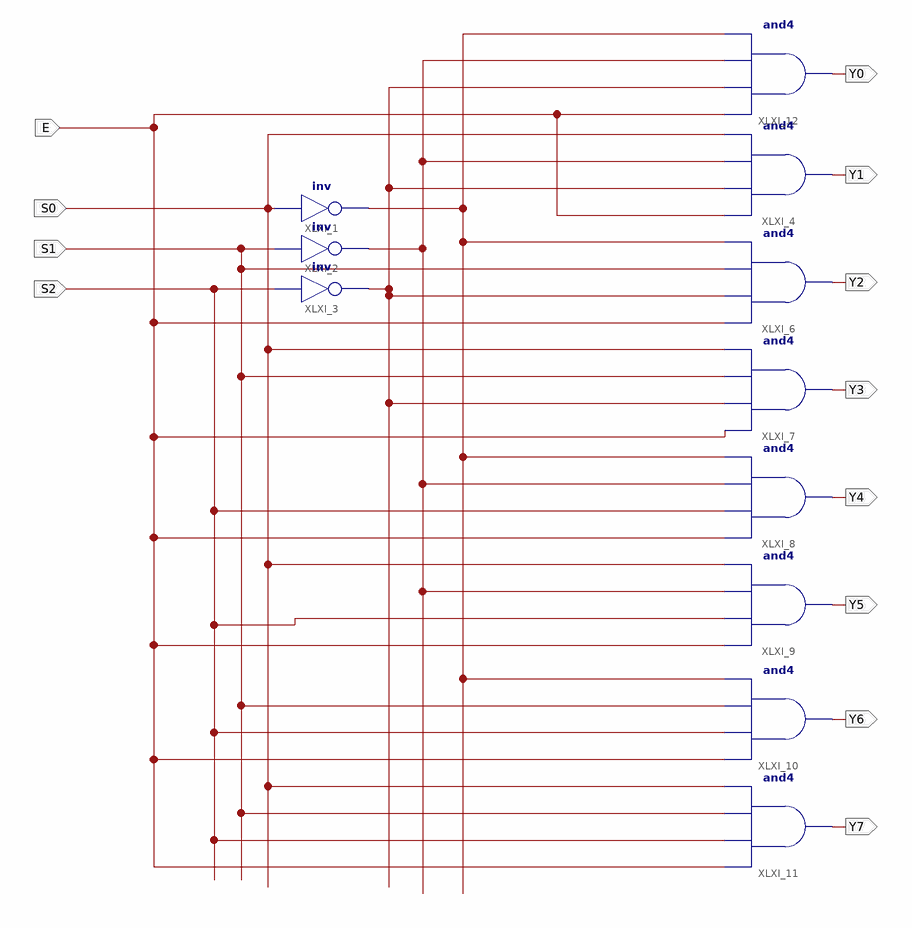
[diagram p0: schematic sheet 1]
// Xilinx ISE schematic decoder_3_8.sch (artix7) as structural Verilog: 11 symbols, 12 ports
module decoder_3_8 (
  input  S1,
  input  S2,
  input  S0,
  input  E,
  output Y0,
  output Y1,
  output Y2,
  output Y3,
  output Y4,
  output Y5,
  output Y6,
  output Y7
);

  wire XLXN_1, XLXN_2, XLXN_7;

  not XLXI_1 (XLXN_1, S0);
  not XLXI_2 (XLXN_2, S1);
  not XLXI_3 (XLXN_7, S2);
  and XLXI_4 (Y1, E, XLXN_7, XLXN_2, S0);
  and XLXI_6 (Y2, E, XLXN_7, S1, XLXN_1);
  and XLXI_7 (Y3, E, XLXN_7, S1, S0);
  and XLXI_8 (Y4, E, S2, XLXN_2, XLXN_1);
  and XLXI_9 (Y5, E, S2, XLXN_2, S0);
  and XLXI_10 (Y6, E, S2, S1, XLXN_1);
  and XLXI_11 (Y7, E, S2, S1, S0);
  and XLXI_12 (Y0, E, XLXN_7, XLXN_2, XLXN_1);
endmodule
